# Altium schematic sheet FLASHSPI_M25PX0.SchDoc: USER - Dual Serial Flash Memory
size A4; Organization: Altium Limited.; Address1: Level 3, 12a Rodborough Rd; Address2: Frenchs Forest 2086; Address3: NSW; Address4: AUSTRALIA; SheetNumber: 1; SheetTotal: 100
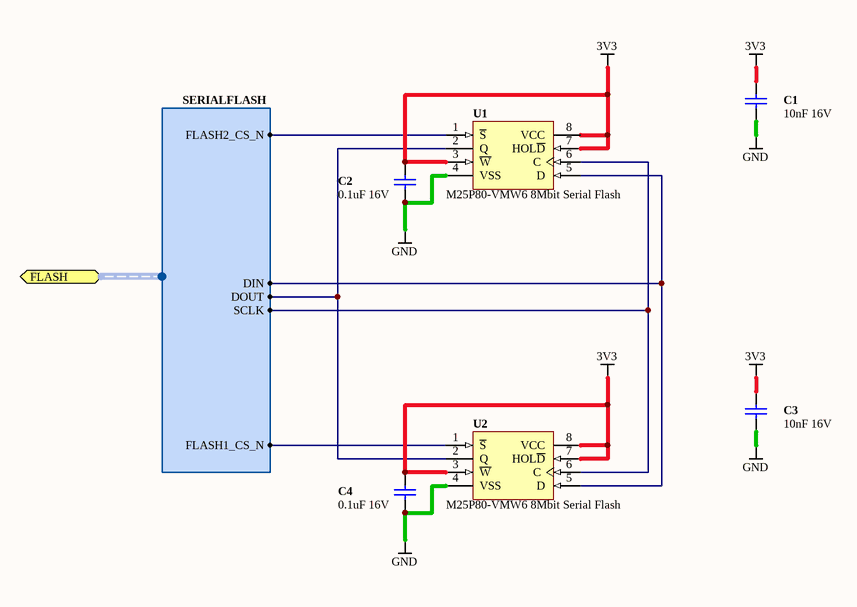
[diagram p0: FLASHSPI_M25PX0.SchDoc]

## Parts
C1  10nF 16V  [CAPC1005-STAR]
C2  0.1uF 16V  [CAPC1005-STAR]
C3  10nF 16V  [CAPC1005-STAR]
C4  0.1uF 16V  [CAPC1005-STAR]
U1  M25P80-VMW6 8Mbit Serial Flash  [SOIC8-200-BODY]
U2  M25P80-VMW6 8Mbit Serial Flash  [SOIC8-200-BODY]

## Ports
FLASH (harness SERIALFLASH)

## Harnesses
SERIALFLASH: FLASH2_CS_N, DIN, DOUT, SCLK, FLASH1_CS_N

## Nets
3V3: C1.1 C2.2 C3.1 C4.2 U1.3(~{W}) U1.7(HOL~{D}) U1.8(VCC) U2.3(~{W}) U2.7(HOL~{D}) U2.8(VCC)
GND: C1.2 C2.1 C3.2 C4.1 U1.4(VSS) U2.4(VSS)
NetU1_1: U1.1(~{S}) ; port FLASH.FLASH2_CS_N
NetU1_2: U1.2(Q) U2.2(Q) ; port FLASH.DOUT
NetU1_5: U1.5(D) U2.5(D) ; port FLASH.DIN
NetU1_6: U1.6(C) U2.6(C) ; port FLASH.SCLK
NetU2_1: U2.1(~{S}) ; port FLASH.FLASH1_CS_N

## Notes on the sheet
- Sheet Title
- Project Title
- Size:
- Date:
- A4
- Assy:
- Time:
- Revision:
- Sheet
- of
- File:

## Library data of the parts
C1 C3 = D-101-0077: Capacitor, Ceramic, 10nF 10% 16V 0402 (1005) X7R; Polarity: Non-Polarized; Category: Capacitor; Capacitance: 10 nF; Dielectric: X7R; Mounting Technology: Surface Mount; Rated Voltage: 16 V; Status: Production; Technology: Ceramic; Tolerance: 10 %
C2 C4 = D-101-0080: Capacitor, Ceramic, 0.1uF 10% 16V 0402 (1005) X7R; Polarity: Non-Polarized; Category: Capacitor; Capacitance: 0.1 uF; Dielectric: X7R; Mounting Technology: Surface Mount; Rated Voltage: 16 V; Status: Production; Technology: Ceramic; Tolerance: 10 %
U1 U2 = D-262-0006: Bit Length: Bits; Speed: ps; Supply Voltage: mV; Category: IC-Flash; Bit Width: Bits; Mounting Technology: Surface Mount; Status: Unreleased